# Altium schematic sheet 20_MIPI_DSI_TX0.SchDoc
size A4
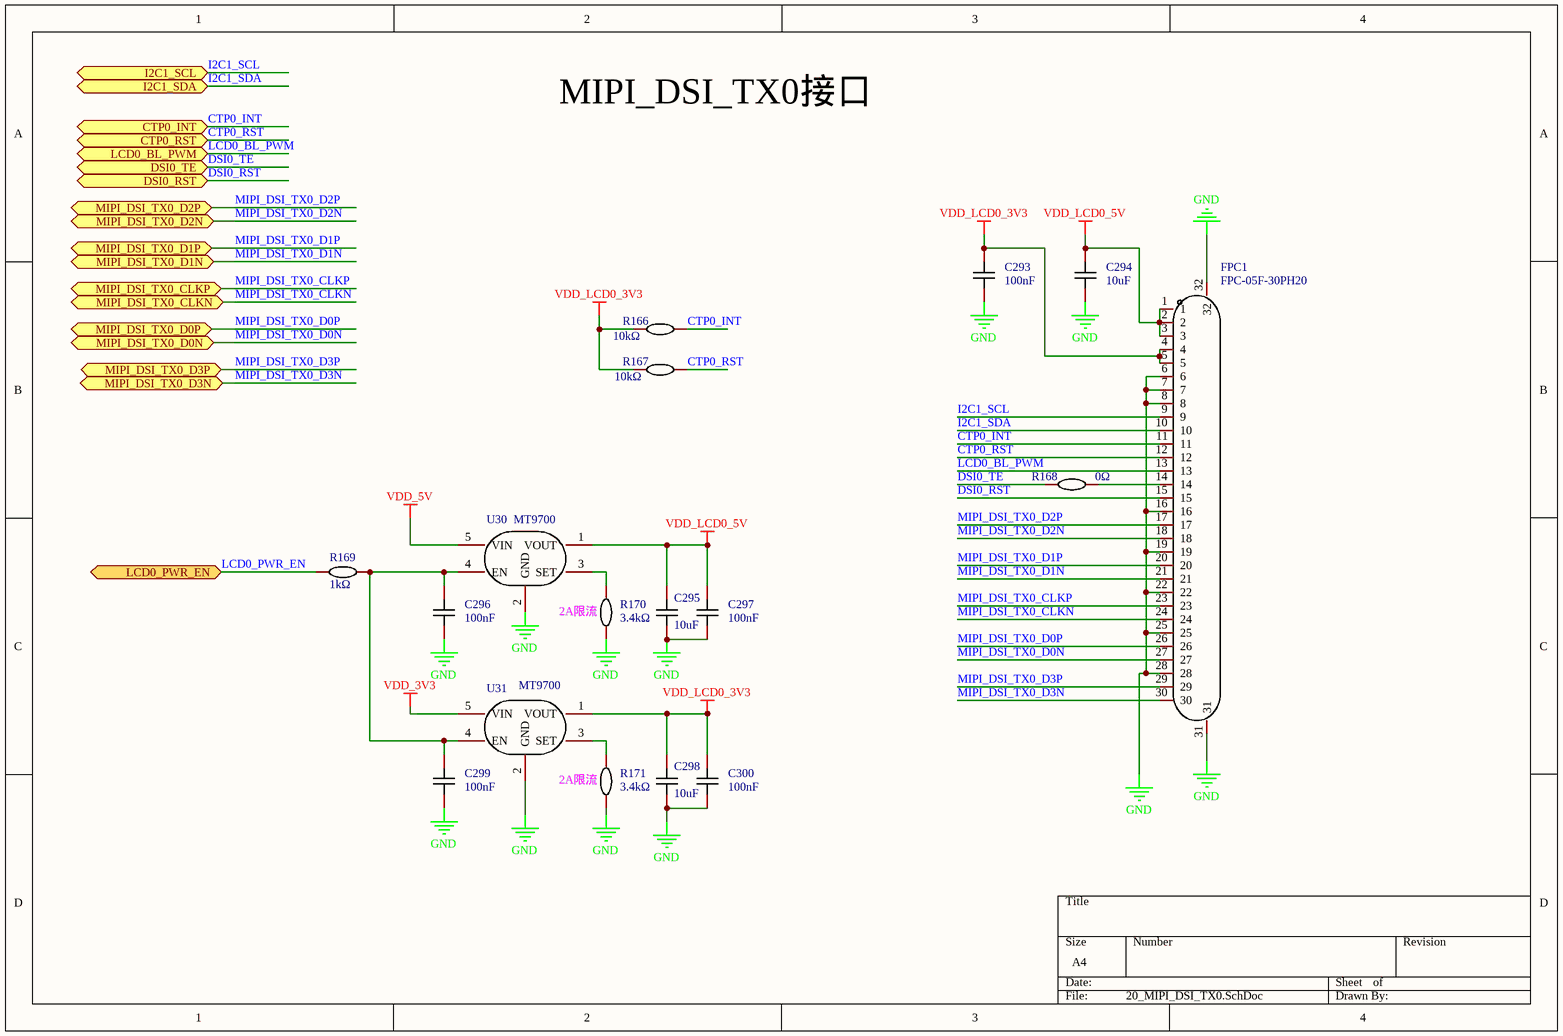
[diagram p0: 20_MIPI_DSI_TX0.SchDoc]

## Parts
C293  100nF  [C0603]
C294  10uF  [C0603]
C295  10uF  [C0603]
C296  100nF  [C0603]
C297  100nF  [C0603]
C298  10uF  [C0603]
C299  100nF  [C0603]
C300  100nF  [C0603]
FPC1  FPC-05F-30PH20  [FPC-SMD_30P-P0.50_XUNPU_FPC-05F-30PH20]
R166  10kΩ  [R0603]
R167  10kΩ  [R0603]
R168  0Ω  [R0603]
R169  1kΩ  [R0603]
R170  3.4kΩ  [R0603]
R171  3.4kΩ  [R0603]
U30  MT9700  [SOT-23-5_L3.0-W1.7-P0.95-LS2.8-BR]
U31  MT9700  [SOT-23-5_L3.0-W1.7-P0.95-LS2.8-BR]

## Ports
CTP0_INT (bidir), CTP0_RST (bidir), DSI0_RST (bidir), DSI0_TE (bidir), I2C1_SCL (bidir), I2C1_SDA (bidir), LCD0_BL_PWM (bidir), LCD0_PWR_EN (bidir), MIPI_DSI_TX0_CLKN (bidir), MIPI_DSI_TX0_CLKP (bidir), MIPI_DSI_TX0_D0N (bidir), MIPI_DSI_TX0_D0P (bidir), MIPI_DSI_TX0_D1N (bidir), MIPI_DSI_TX0_D1P (bidir), MIPI_DSI_TX0_D2N (bidir), MIPI_DSI_TX0_D2P (bidir), MIPI_DSI_TX0_D3N (bidir), MIPI_DSI_TX0_D3P (bidir)

## Nets
GND: C293.1 C294.1 C295.1 C296.1 C297.1 C298.1 C299.1 C300.1 FPC1.6 FPC1.7 FPC1.8 FPC1.16 FPC1.19 FPC1.22 FPC1.25 FPC1.28 FPC1.31 FPC1.32 R170.1 R171.1 U30.2(GND) U31.2(GND)
VDD_3V3: U31.5(VIN)
VDD_5V: U30.5(VIN)
VDD_LCD0_3V3: C293.2 C298.2 C300.2 FPC1.4 FPC1.5 R166.2 R167.2 U31.1(VOUT)
VDD_LCD0_5V: C294.2 C295.2 C297.2 FPC1.1 FPC1.2 FPC1.3 U30.1(VOUT)
CTP0_INT: FPC1.11 R166.1 ; port CTP0_INT
CTP0_RST: FPC1.12 R167.1 ; port CTP0_RST
DSI0_RST: FPC1.15 ; port DSI0_RST
DSI0_TE: R168.1 ; port DSI0_TE
I2C1_SCL: FPC1.9 ; port I2C1_SCL
I2C1_SDA: FPC1.10 ; port I2C1_SDA
LCD0_BL_PWM: FPC1.13 ; port LCD0_BL_PWM
LCD0_PWR_EN: R169.1 ; port LCD0_PWR_EN
MIPI_DSI_TX0_CLKN: FPC1.24 ; port MIPI_DSI_TX0_CLKN
MIPI_DSI_TX0_CLKP: FPC1.23 ; port MIPI_DSI_TX0_CLKP
MIPI_DSI_TX0_D0N: FPC1.27 ; port MIPI_DSI_TX0_D0N
MIPI_DSI_TX0_D0P: FPC1.26 ; port MIPI_DSI_TX0_D0P
MIPI_DSI_TX0_D1N: FPC1.21 ; port MIPI_DSI_TX0_D1N
MIPI_DSI_TX0_D1P: FPC1.20 ; port MIPI_DSI_TX0_D1P
MIPI_DSI_TX0_D2N: FPC1.18 ; port MIPI_DSI_TX0_D2N
MIPI_DSI_TX0_D2P: FPC1.17 ; port MIPI_DSI_TX0_D2P
MIPI_DSI_TX0_D3N: FPC1.30 ; port MIPI_DSI_TX0_D3N
MIPI_DSI_TX0_D3P: FPC1.29 ; port MIPI_DSI_TX0_D3P
NetC296_2: C296.2 C299.2 R169.2 U30.4(EN) U31.4(EN)
NetFPC1_14: FPC1.14 R168.2
NetR170_2: R170.2 U30.3(SET)
NetR171_2: R171.2 U31.3(SET)

## Notes on the sheet
- MIPI_DSI_TX0接口
- 2A限流

## Library data of the parts
C293 C296 C297 C299 C300 = CC0603KRX7R9BB104: Manufacturer: YAGEO(国巨); Add into BOM: yes; Tolerance: ±10%; Voltage Rated: 50V; Temperature Coefficient: X7R; Name: 100nF; Symbol: CC0603KRX7R9BB104; Device: CC0603KRX7R9BB104; Supplier: LCSC; Manufacturer Part: CC0603KRX7R9BB104; Value: 100nF; Supplier Part: C14663; JLCPCB Part Class: 基础库; LCSC Part Name: 100nF ±10% 50V; Supplier Footprint: 0603; Datasheet: https://atta.szlcsc.com/upload/public/pdf/source/20180910/C282072_33301C7F631E79921B82A8DAC6BCC5B3.pdf; Convert to PCB: yes
C294 C295 C298 = CL10A106KP8NNNC: Manufacturer: SAMSUNG(三星); Add into BOM: yes; Tolerance: ±10%; Voltage Rated: 10V; Temperature Coefficient: X5R; Name: 10uF; Symbol: CL10A106KP8NNNC; Device: CL10A106KP8NNNC; Supplier: LCSC; Manufacturer Part: CL10A106KP8NNNC; Value: 10uF; Supplier Part: C19702; JLCPCB Part Class: 基础库; LCSC Part Name: 10uF ±10% 10V; Supplier Footprint: 0603; Datasheet: https://atta.szlcsc.com/upload/public/pdf/source/20160218/1457707763339.pdf; Convert to PCB: yes
FPC1 = FPC-05F-30PH20: Manufacturer: XUNPU(讯普); Add into BOM: yes; Locking Feature: 翻盖式; Number of Contacts: 30P; Pitch: 0.5mm; FFC, FCB Thickness: 0.3mm; Name: FPC-05F-30PH20; Symbol: FPC-05F-30PH20; Device: FPC-05F-30PH20; Supplier: LCSC; Supplier Part: C2856808; Manufacturer Part: FPC-05F-30PH20; JLCPCB Part Class: 扩展库; LCSC Part Name: 间距:0.5mm P数:30P 翻盖式 下接; Supplier Footprint: SMD,P=0.5mm,卧贴; Datasheet: https://atta.szlcsc.com/upload/public/pdf/source/20210922/C2856808_4E6DDE2793CFD9EF09B771A8BD3338A4.pdf; Convert to PCB: yes; Contact Type: 下接; Mounting Type: 卧贴; Height Above Board: 2mm; Operating Temperature Range: -25℃~+85℃
R166 R167 = 0603WAF1002T5E: Manufacturer: UNI-ROYAL(厚声); Add into BOM: yes; Tolerance: ±1%; Power(Watts): 100mW; Overload Voltage (Max): 75V; Temperature Coefficient: ±100ppm/℃; Name: 10kΩ; Symbol: 0603WAF1002T5E; Device: 0603WAF1002T5E; Supplier: LCSC; Manufacturer Part: 0603WAF1002T5E; Supplier Part: C25804; Value: 10kΩ; JLCPCB Part Class: 基础库; LCSC Part Name: 厚膜电阻 10kΩ ±1% 100mW; Supplier Footprint: 0603; Datasheet: https://atta.szlcsc.com/upload/public/pdf/source/20200306/C422600_1E6D84923E4A46A82E41ADD87F860B5C.pdf; Convert to PCB: yes; Type: 厚膜电阻; Operating Temperature Range: -55℃~+155℃
R168 = 0603WAF0000T5E: Manufacturer: UNI-ROYAL(厚声); Add into BOM: yes; Tolerance: ±1%; Power(Watts): 100mW; Overload Voltage (Max): 75V; Name: 0Ω; Symbol: 0603WAF0000T5E; Device: 0603WAF0000T5E; Supplier: LCSC; Manufacturer Part: 0603WAF0000T5E; Supplier Part: C21189; Value: 0Ω; JLCPCB Part Class: 基础库; LCSC Part Name: 0Ω ±1% 100mW 厚膜电阻; Supplier Footprint: 0603; Datasheet: https://atta.szlcsc.com/upload/public/pdf/source/20200306/C422600_1E6D84923E4A46A82E41ADD87F860B5C.pdf; Convert to PCB: yes; Type: 厚膜电阻; Operating Temperature Range: -55℃~+155℃
R169 = RC0603FR-071KL: Manufacturer: YAGEO(国巨); Add into BOM: yes; Tolerance: ±1%; Power(Watts): 100mW; Overload Voltage (Max): 75V; Temperature Coefficient: ±100ppm/℃; Name: 1kΩ; Symbol: RC0603FR-071KL; Device: RC0603FR-071KL; LCSC Part Name: 厚膜电阻 1kΩ ±1% 100mW; Supplier Part: C22548; Manufacturer Part: RC0603FR-071KL; Supplier Footprint: 0603; JLCPCB Part Class: 扩展库; Datasheet: https://atta.szlcsc.com/upload/public/pdf/source/20180316/70C0E2BDAE7FCC62C531A5A58D202EE1.pdf; Supplier: LCSC; Convert to PCB: yes; Type: 厚膜电阻; Value: 1kΩ; Operating Temperature Range: -55℃~+155℃
R170 R171 = 0603WAF3401T5E: Manufacturer: UNI-ROYAL(厚声); Add into BOM: yes; Tolerance: ±1%; Power(Watts): 100mW; Overload Voltage (Max): 75V; Temperature Coefficient: ±100ppm/℃; Name: 3.4kΩ; Symbol: 0603WAF3401T5E; Device: 0603WAF3401T5E; Supplier: LCSC; Manufacturer Part: 0603WAF3401T5E; Supplier Part: C22997; Value: 3.4kΩ; JLCPCB Part Class: 扩展库; LCSC Part Name: 3.4kΩ ±1% 100mW 厚膜电阻; Supplier Footprint: 0603; Datasheet: https://atta.szlcsc.com/upload/public/pdf/source/20200306/C422600_1E6D84923E4A46A82E41ADD87F860B5C.pdf; Convert to PCB: yes; Type: 厚膜电阻; Operating Temperature Range: -55℃~+155℃
U30 U31 = MT9700: Manufacturer: 西安航天民芯; Add into BOM: yes; Name: MT9700; Symbol: MT9700; Device: MT9700; LCSC Part Name: MT9700; Supplier Part: C89855; Manufacturer Part: MT9700; Supplier Footprint: SOT-23-5; JLCPCB Part Class: 扩展库; Datasheet: https://atta.szlcsc.com/upload/public/pdf/source/20170418/1492481333031.pdf; Supplier: LCSC; Convert to PCB: yes